# EAGLE design myStrava (EAGLE 6.6.0)
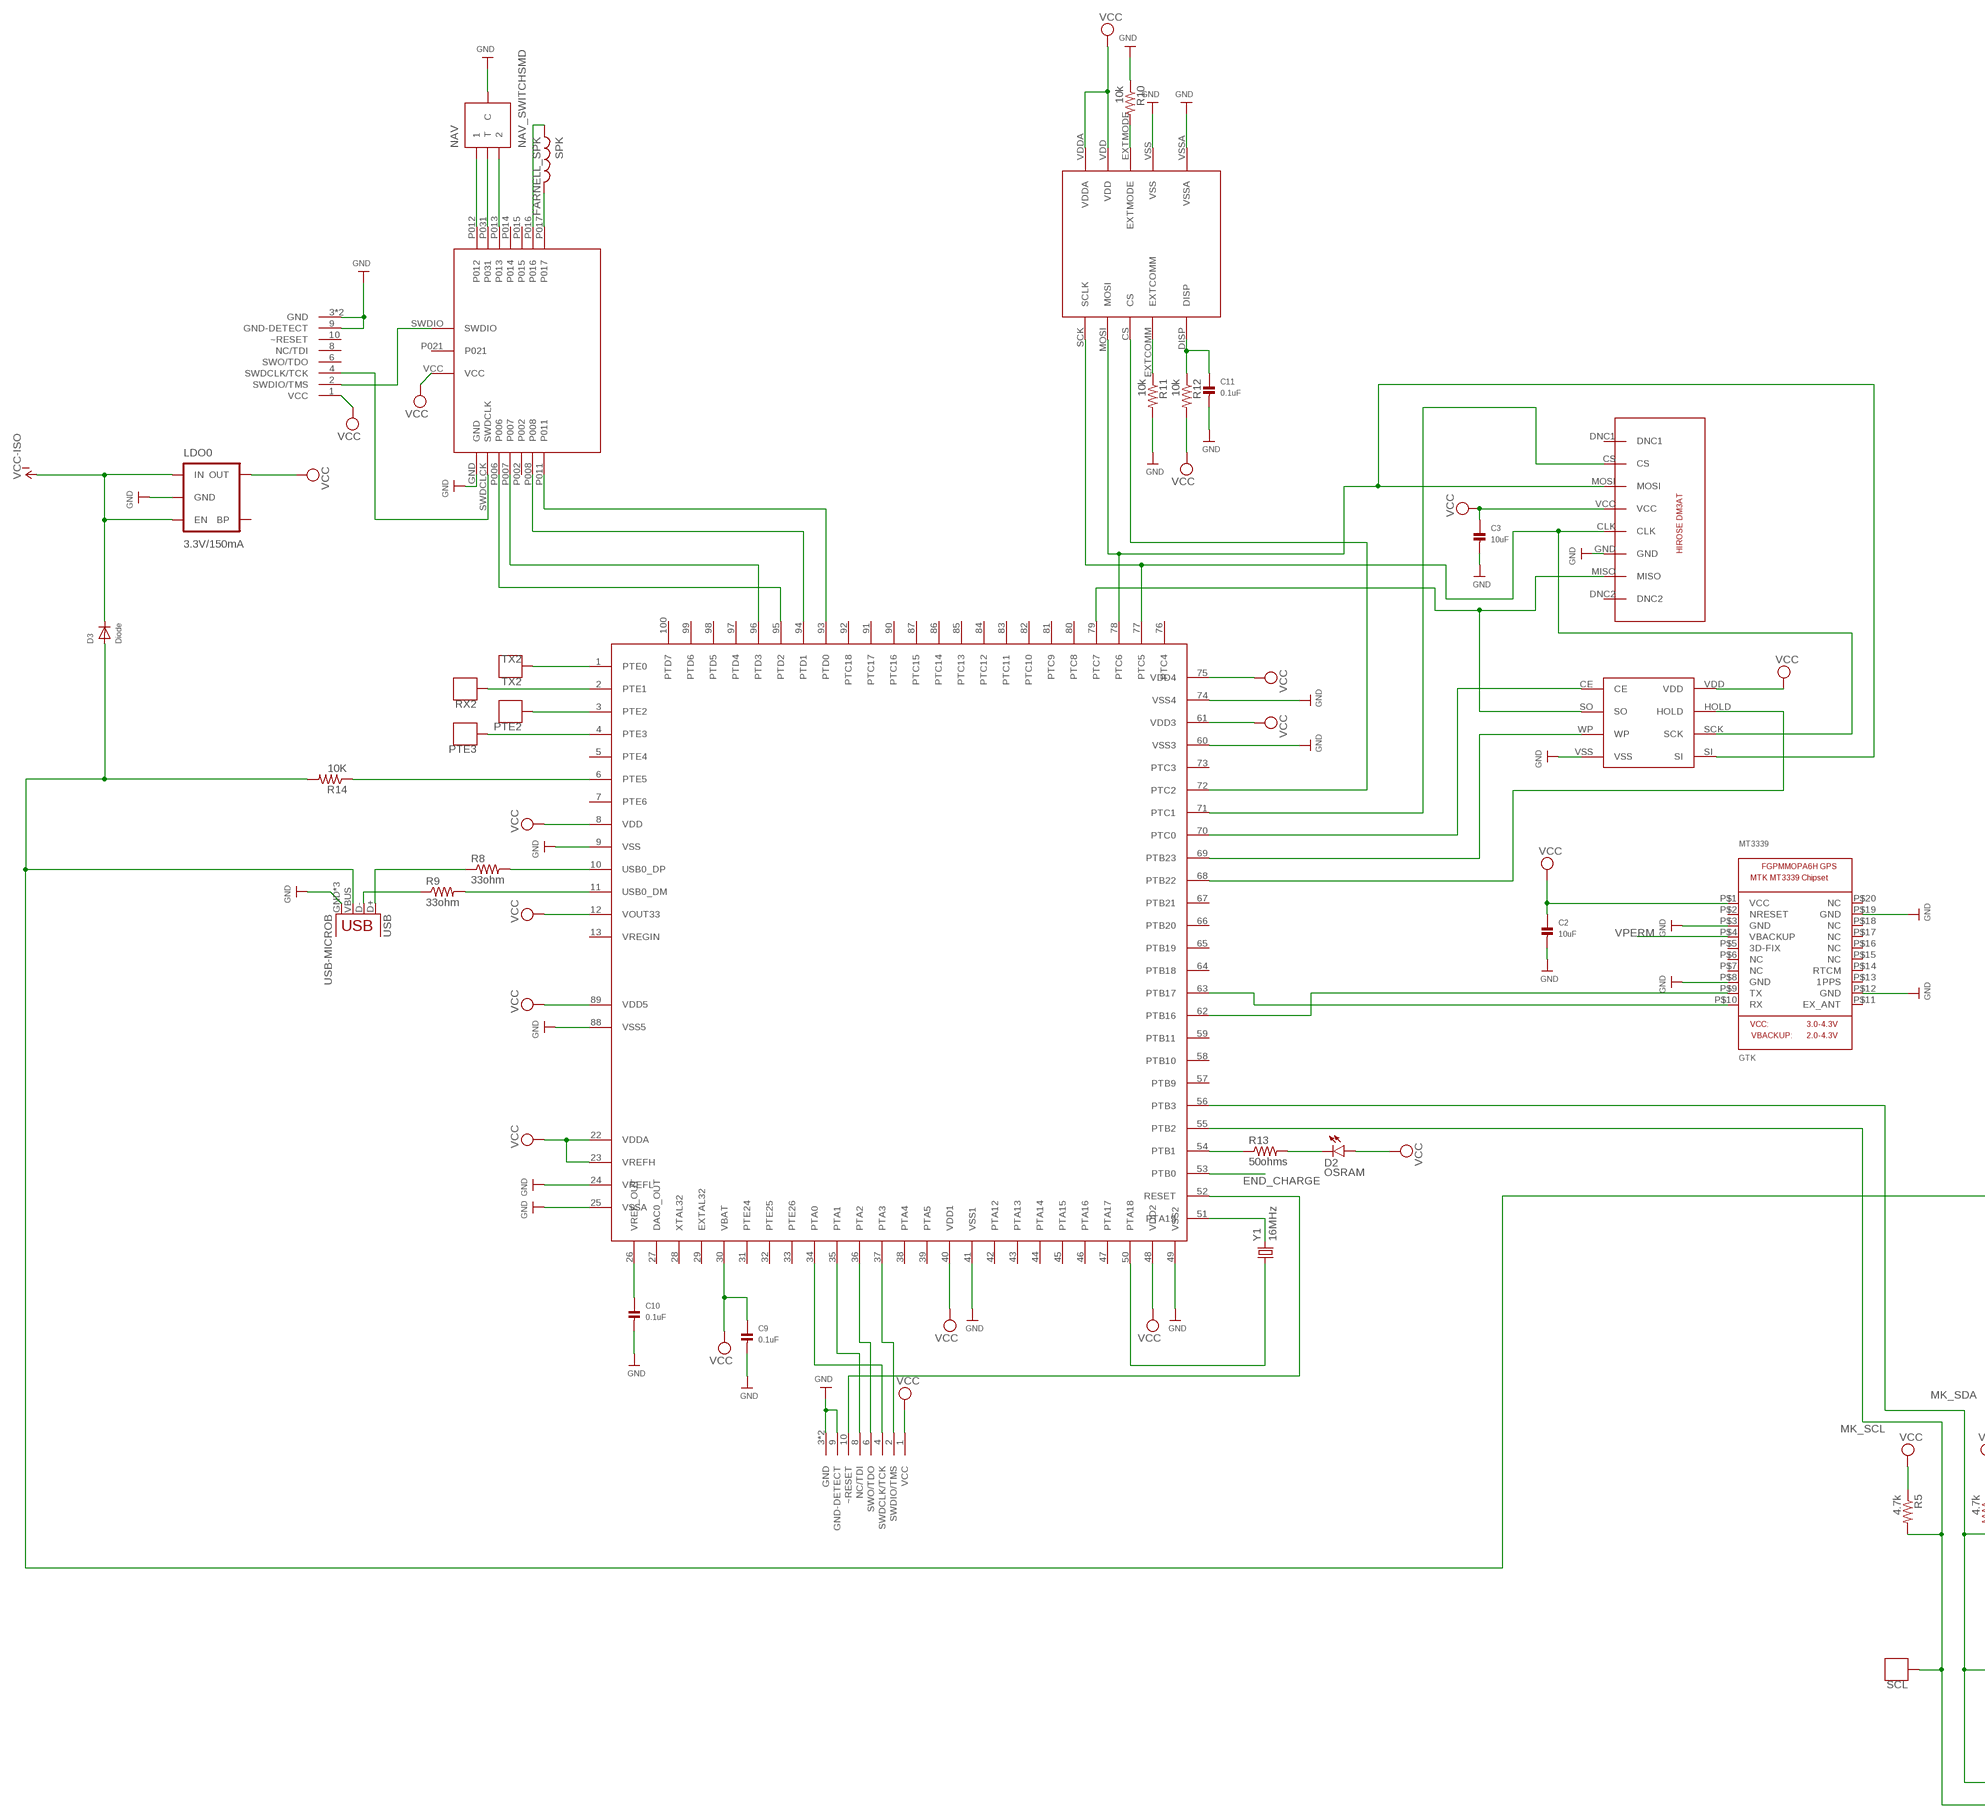
[diagram p0: schematic, sheet 1, part 1 of 2]
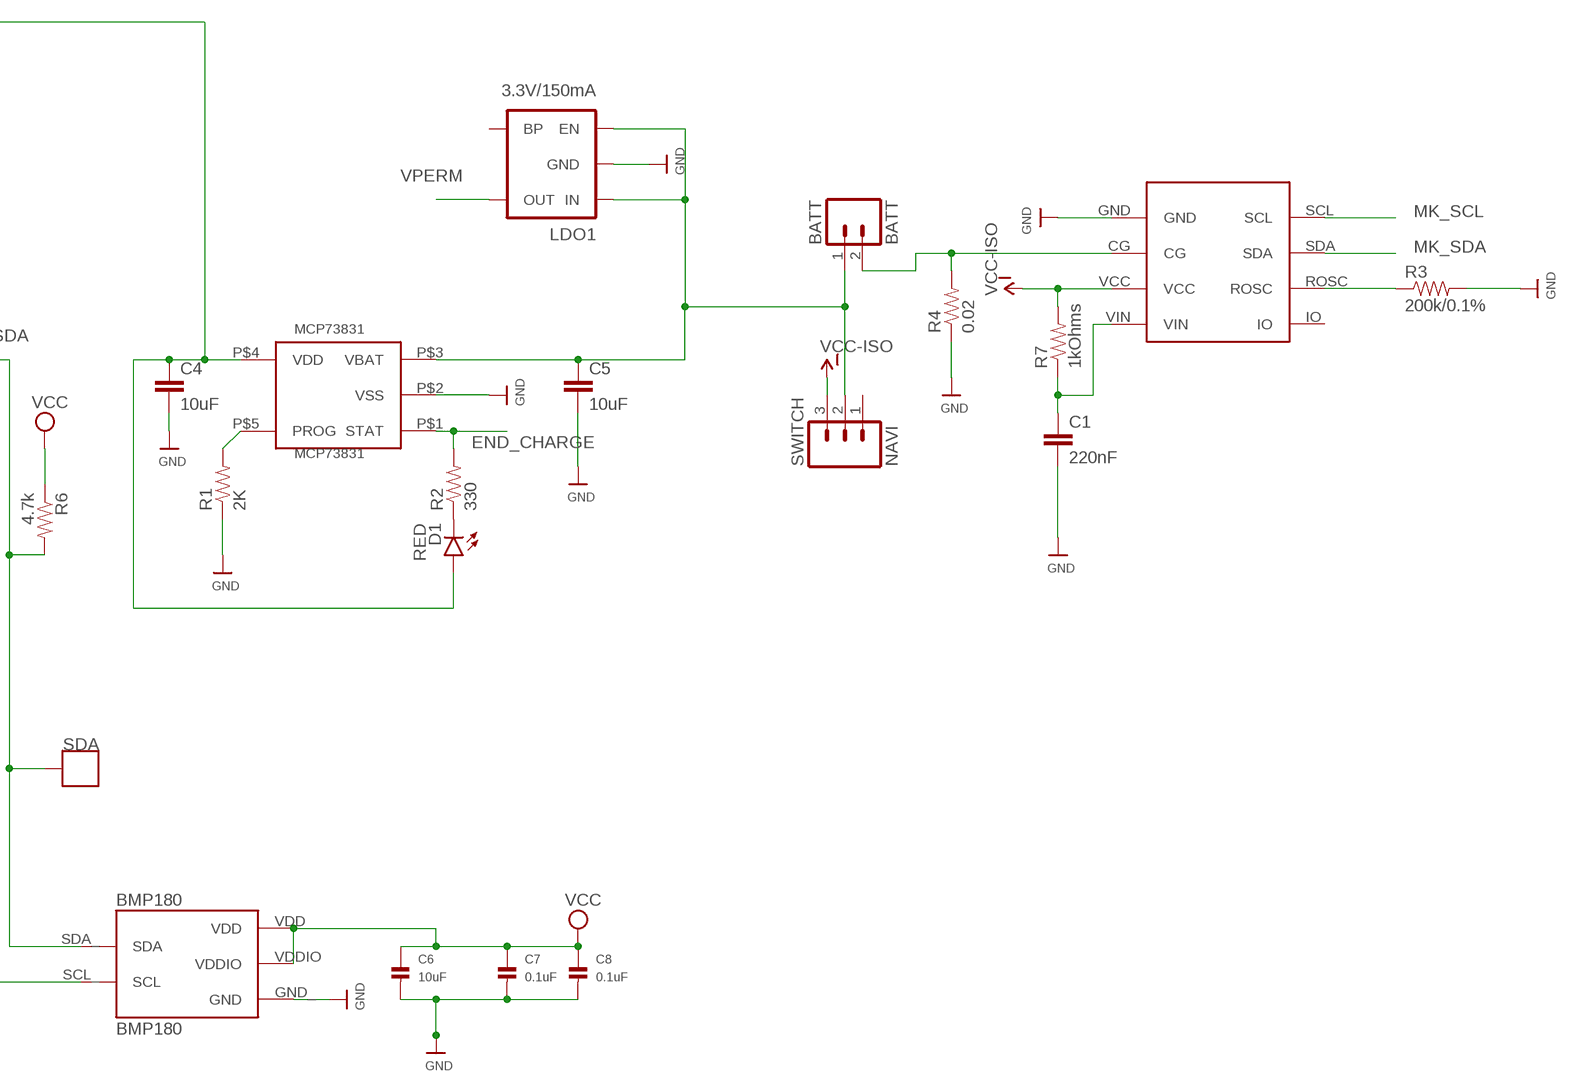
[diagram p1: schematic, sheet 1, part 2 of 2]

## Parts
BATT  BATT  M02PTH3  [1X02_LONGPADS]
BMP180  BMP180  [BMP180]
C1  220nF  10UF-6.3V-20%(1206)  [1206]
C2  10uF  CAP_CERAMIC1206  [1206]
C3  10uF  CAP_CERAMIC1206  [1206]
C4  10uF  10UF-6.3V-20%(1206)  [1206]
C5  10uF  10UF-6.3V-20%(1206)  [1206]
C6  10uF  CAP_CERAMIC1206  [1206]
C7  0.1uF  CAP_CERAMIC1206  [1206]
C8  0.1uF  CAP_CERAMIC1206  [1206]
C9  0.1uF  CAP_CERAMIC1206  [1206]
C10  0.1uF  CAP_CERAMIC1206  [1206]
C11  0.1uF  CAP_CERAMIC1206  [1206]
D1  RED  LED-RED1206  [LED-1206]
D2  OSRAM  LED-RED1206  [LED-1206]
D3  Diode  DIODE_SOD-123FL  [SOD-123FL]
JTAG  2X5_0.05"_CORTEX_DEBUGTH_NOKEY_UNSHROUDED  [2X5_0.05"_TH_NS]
JTAG1  2X5_0.05"_CORTEX_DEBUGTH_NOKEY_UNSHROUDED  [2X5_0.05"_TH_NS]
LDO0  3.3V/150mA  V_REG_MIC52053.3V  [SOT23-5]
LDO1  3.3V/150mA  V_REG_MIC52053.3V  [SOT23-5]
MCP73831  MCP73831  [5PIN_SOT23]
MK20DN512  MK20DN512  [LQFP-100]
MT3339  GTK  GPS_FGPMMOPA6H  [FGPMMOPA6H]
N550  ANTAP28  [ANTAP]
NAV  NAV_SWITCHSMD  [NAV_SWITCH]
PTE2  MDMK2020T4R7MM  [IND-2020]
PTE3  MDMK2020T4R7MM  [IND-2020]
R1  2K  RESISTOR1206  [1206]
R2  330  RESISTOR1206  [1206]
R3  200k/0.1%  RESISTOR1206  [1206]
R4  0.02  RESISTOR1206  [1206]
R5  4.7k  RESISTOR1206  [1206]
R6  4.7k  RESISTOR1206  [1206]
R7  1kOhms  RESISTOR1206  [1206]
R8  33ohm  RESISTOR0805-RES  [0805]
R9  33ohm  RESISTOR0805-RES  [0805]
R10  10k  RESISTOR1206  [1206]
R11  10k  RESISTOR1206  [1206]
R12  10k  RESISTOR1206  [1206]
R13  50ohms  RESISTOR1206  [1206]
R14  10K  RESISTOR1206  [1206]
RX2  MDMK2020T4R7MM  [IND-2020]
SCL  MDMK2020T4R7MM  [IND-2020]
SD  DM3AT  [DM3AT]
SDA  MDMK2020T4R7MM  [IND-2020]
SHARP  SHARP27  [SHARP27]
SPK  FARNELL_SPK  MDMK2020T4R7MM  [IND-2020]
SST25  FLASH  [SOIC8]
STC3100  STC3100  [STC3100]
SWITCH  NAVI  M03LOCK  [1X03_LOCK]
TX2  TX2  MDMK2020T4R7MM  [IND-2020]
USB  USB-MICROB  [USB-MICROB]
Y1  16MHz  CRYSTALHC49UV  [HC49U-V]

## Nets
END_CHARGE: MCP73831.P$1(STAT) MK20DN512.53(PTB0) R2.2
GND [pwr]: BMP180.GND_(GND) C1.2 C2.2 C3.2 C4.2 C5.2 C6.2 C7.2 C8.2 C9.2 C10.2 C11.2 JTAG1.3(GND) JTAG1.5(GND) JTAG1.9(GND-DETECT) JTAG.3(GND) JTAG.5(GND) JTAG.9(GND-DETECT) LDO0.2(GND) LDO1.2(GND) MCP73831.P$2(VSS) MK20DN512.9(VSS) MK20DN512.24(VREFL) MK20DN512.25(VSSA) MK20DN512.41(VSS1) MK20DN512.49(VSS2) MK20DN512.60(VSS3) MK20DN512.74(VSS4) MK20DN512.88(VSS5) MT3339.P$3(GND) MT3339.P$8(GND) MT3339.P$12(GND) MT3339.P$19(GND) N550.GND NAV.C R1.1 R3.2 R4.1 R10.1 R11.2 SD.GND SHARP.VSS SHARP.VSSA SST25.VSS STC3100.GND USB.GND USB.MT1(GND) USB.MT2(GND)
MK_DI: MK20DN512.79(PTC7) SD.MISO SST25.SO
MK_DO: MK20DN512.78(PTC6) SD.MOSI SHARP.MOSI SST25.SI
MK_RX1: MK20DN512.62(PTB16) MT3339.P$9(TX)
MK_RX2: MK20DN512.2(PTE1) RX2.P$1
MK_RX3: MK20DN512.95(PTD2) N550.P006
MK_SCL: BMP180.SCL_(SCL) MK20DN512.55(PTB2) R5.2 SCL.P$1 STC3100.SCL
MK_SCLK: MK20DN512.77(PTC5) SD.CLK SHARP.SCK(SCLK) SST25.SCK
MK_SDA: BMP180.SDA_(SDA) MK20DN512.56(PTB3) R6.2 SDA.P$1 STC3100.SDA
MK_TX1: MK20DN512.63(PTB17) MT3339.P$10(RX)
MK_TX2: MK20DN512.1(PTE0) TX2.P$1
MK_TX3: MK20DN512.96(PTD3) N550.P007
MK_USB_DETECT: MK20DN512.6(PTE5) R14.1
N$1: MK20DN512.71(PTC1) SD.CS
N$2 [charge]: BATT.1 C5.1 LDO1.1(IN) LDO1.3(EN) MCP73831.P$3(VBAT) SWITCH.2
N$3: N550.P017 SPK.P$2
N$4: R3.1 STC3100.ROSC
N$5: C1.1 R7.1 STC3100.VIN
N$6: BATT.2 R4.2 STC3100.CG
N$7: N550.P016 SPK.P$1
N$8: N550.P012 NAV.1
N$9: N550.P031 NAV.T
N$10: N550.P013 NAV.2
N$11: JTAG1.2(SWDIO/TMS) N550.SWDIO
N$12: JTAG1.4(SWDCLK/TCK) N550.SWDCLCK(SWDCLK)
N$14: MK20DN512.51(PTA19) Y1.2
N$15: MK20DN512.69(PTB23) SST25.WP
N$16: MCP73831.P$5(PROG) R1.2
N$17: D2.C R13.2
N$18: MK20DN512.94(PTD1) N550.P008
N$19: MK20DN512.50(PTA18) Y1.1
N$20: D1.C R2.1
N$21: MK20DN512.93(PTD0) N550.P011
N$22: MK20DN512.72(PTC2) SHARP.CS
N$23: C10.1 MK20DN512.26(VREF_OUT)
N$24: MK20DN512.68(PTB22) SST25.HOLD
N$25: R10.2 SHARP.EXTMODE
N$26: R11.1 SHARP.EXTCOMM
N$27: C11.1 R12.1 SHARP.DISP
N$28: MK20DN512.3(PTE2) PTE2.P$1
N$30: MK20DN512.4(PTE3) PTE3.P$1
N$31: MK20DN512.54(PTB1) R13.1
N$32: MK20DN512.70(PTC0) SST25.CE
N$35: JTAG.10(~RESET) MK20DN512.52(RESET)
TCLK: JTAG.4(SWDCLK/TCK) MK20DN512.34(PTA0)
TDI: JTAG.8(NC/TDI) MK20DN512.35(PTA1)
TDO: JTAG.6(SWO/TDO) MK20DN512.36(PTA2)
TMS: JTAG.2(SWDIO/TMS) MK20DN512.37(PTA3)
USB1_DM_N [usb]: R9.1 USB.D-
USB1_DM_P [usb]: R8.1 USB.D+
USB_DM_N [usb]: MK20DN512.11(USB0_DM) R9.2
USB_DM_P [usb]: MK20DN512.10(USB0_DP) R8.2
USB_V+ [charge]: C4.1 D1.A D3.A MCP73831.P$4(VDD) R14.2 USB.VBUS
VCC: BMP180.VDD BMP180.VDDIO C2.1 C3.1 C6.1 C7.1 C8.1 C9.1 D2.A JTAG1.1(VCC) JTAG.1(VCC) LDO0.5(OUT) MK20DN512.8(VDD) MK20DN512.12(VOUT33) MK20DN512.22(VDDA) MK20DN512.23(VREFH) MK20DN512.30(VBAT) MK20DN512.40(VDD1) MK20DN512.48(VDD2) MK20DN512.61(VDD3) MK20DN512.75(VDD4) MK20DN512.89(VDD5) MT3339.P$1(VCC) N550.VCC R5.1 R6.1 R12.2 SD.VCC SHARP.VDD SHARP.VDDA SST25.VDD
VCC-ISO [pwr]: D3.C LDO0.1(IN) LDO0.3(EN) R7.2 STC3100.VCC SWITCH.3
VPERM: LDO1.5(OUT) MT3339.P$4(VBACKUP)
Unconnected: JTAG1.6(SWO/TDO) JTAG1.8(NC/TDI) JTAG1.10(~RESET) LDO0.4(BP) LDO1.4(BP) MK20DN512.5(PTE4) MK20DN512.7(PTE6) MK20DN512.13(VREGIN) MK20DN512.27(DAC0_OUT) MK20DN512.28(XTAL32) MK20DN512.29(EXTAL32) MK20DN512.31(PTE24) MK20DN512.32(PTE25) MK20DN512.33(PTE26) MK20DN512.38(PTA4) MK20DN512.39(PTA5) MK20DN512.42(PTA12) MK20DN512.43(PTA13) MK20DN512.44(PTA14) MK20DN512.45(PTA15) MK20DN512.46(PTA16) MK20DN512.47(PTA17) MK20DN512.57(PTB9) MK20DN512.58(PTB10) MK20DN512.59(PTB11) MK20DN512.64(PTB18) MK20DN512.65(PTB19) MK20DN512.66(PTB20) MK20DN512.67(PTB21) MK20DN512.73(PTC3) MK20DN512.76(PTC4) MK20DN512.80(PTC8) MK20DN512.81(PTC9) MK20DN512.82(PTC10) MK20DN512.83(PTC11) MK20DN512.84(PTC12) MK20DN512.85(PTC13) MK20DN512.86(PTC14) MK20DN512.87(PTC15) MK20DN512.90(PTC16) MK20DN512.91(PTC17) MK20DN512.92(PTC18) MK20DN512.97(PTD4) MK20DN512.98(PTD5) MK20DN512.99(PTD6) MK20DN512.100(PTD7) MT3339.P$2(NRESET) MT3339.P$5(3D-FIX) MT3339.P$6(NC) MT3339.P$7(NC) MT3339.P$11(EX_ANT) MT3339.P$13(1PPS) MT3339.P$14(RTCM) MT3339.P$15(NC) MT3339.P$16(NC) MT3339.P$17(NC) MT3339.P$18(NC) MT3339.P$20(NC) N550.P002 N550.P014 N550.P015 N550.P021 SD.DNC1 SD.DNC2 STC3100.IO SWITCH.1

## Library data of the parts
BATT = SparkFun-Connectors:M02: Standard 2-pin 0.1" header. Use with - straight break away headers ( PRT-00116) - right angle break away headers (PRT-00553) - swiss pins (PRT-00743) - machine pins (PRT-00117) - female headers (PRT-00115) Molex polarized connector foot print use with: PRT-08233 with associated crimp pins and housings. 2.54_SCREWTERM for use with PRT-10571. 3.5mm Screw Terminal footprints for PRT-08084 5mm Screw Terminal footprints for use with PRT-08432
BMP180 = SparkFun-Sensors:BMP180: BOSCH BMP180 DIGITAL BAROMETRIC PRESSURE SENSOR Web page: http://www.bosch-sensortec.com/en/homepage/products_3/environmental_sensors_1/bmp180_1/bmp180 Datasheet: http://ae-bst.resource.bosch.com/media/products/dokumente/bmp180/BST-BMP180-DS000-09.pdf The BMP180 is the function compatible successor of the BMP085, a new generation of high precision digital pressure sensors for consumer applications. The ultra-low power, low voltage electronics of the BMP180 is optimized for use in mobile phones, PDAs, GPS navigation devices and outdoor equipment. With a low altitude noise of merely 0.25m at fast conversion time, the BMP180 offers superior performance. The I2C interface allows for easy system integration with a microcontroller. The BMP180 is based on piezo-resistive technology for EMC robustness, high accuracy and linearity as well as long term stability. Key features: - Temperature measurement included - I2C interface - Fully calibrated - Pb-free, halogen-free and RoHS compliant, - MSL 1 Basic specs: Pressure range: 300 to 1100hPa (+9000m to -500m relating to sea level) Supply voltage: 1.8 to 3.6V (VDD), 1.62V to 3.6V (VDDIO) Package: LGA package with metal lid Small footprint: 3.6mm x 3.8mm Super-flat: 0.93mm height Low power: 5µA at 1 sample / sec. in standard mode Low noise: 0.06hPa (0.5m) in ultra low power mode, 0.02hPa (0.17m) advanced resolution mode Typical applications: - Enhancement of GPS navigation (dead-reckoning, slope detection, etc.) - In- and out-door navigation - Leisure and sports - Weather forecast - Vertical velocity indication (rise/sink speed)
C1 = SparkFun-Capacitors:10UF-6.3V-20%(1206): CAP-10057 Ceramic; PROD_ID: CAP-10057; VALUE: 10uF
C2 C3 C6-C11 = microbuilder:CAP_CERAMIC: Ceramic Capacitors 0402 - 0402 Surface Mount Capacitors 16pF 50V 5% [Digikey: 445-4899-2-ND] 18pF 50V 5% [Digikey: 490-1281-2-ND] 22pF 50V 5% [Digikey: 490-1283-2-ND] 68pF 50V 5% [Digikey: 490-1289-2-ND] 0.1uF 10V 10% [Digikey: 490-1318-2-ND] 1.0uF 6.3V 10% [Digikey: 490-1320-2-ND] 0603 - 0603 Surface Mount Capacitors 16 pF 50V 5% [Digikey: 445-5051-2-ND] 22 pF 50V [Digikey: PCC220ACVTR-ND] 33 pF 50V 5% [Digikey: 490-1415-1-ND] 56pF 50V 5% [Digikey: 490-1421-1-ND] 220pF 50V 5% [Digikey: 445-1285-1-ND] 680 pF 50V 2200 pF 50V 5% C0G [Digikey: 445-1297-1-ND] 5600 pF 100V 5% X7R [Digikey: 478-3711-1-ND] 0.1 µF 25V 10% [Digikey: PCC2277TR-ND] 0.22 µF 16V 10% X7R [Digikey: 445-1318-1-ND] 1.0 µF 25V 10% [Digikey: 445-5146-2-ND] 0603 - RF Specific 3pF 250V +/-0.1pF RF [Digikey: 712-1347-1-ND] 18 pF 250V 5% [Digikey: 478-3505-1-ND or 712-1322-1-ND] 56 pF 250V 5% C0G RF [Digikey: 490-4867-1-ND] 68 pF 250V RF [Digikey: 490-4868-1-ND] 0805 - 0805 Surface Mount Capacitors 220 pF 250V 2% RF Ceramic Capacitor [Digikey: 712-1398-1-ND] 1000 pF 50V 2% NP0 Ceramic Capacitor [Digikey: 478-3760-1-ND] 0.1 µF 25V 10% Ceramic Capacitor [Digikey: PCC1828TR-ND] 1.0 µF 16V 10% Ceramic Capacitor[Digikey: 490-1691-2-ND] 10.0 µF 10V 10% Ceramic Capacitor[Digikey: 709-1228-1-ND] 10.0 uF 16V 10% Ceramic Capacitor [Digikey: 478-5165-2-ND] 47 uF 6.3V 20% Ceramic Capacitor [Digikey: 587-1779-1-ND or 399-5506-1-ND] 1206 - 1206 Surface Mount Capacitors 47uF 10V 20% Ceramic Capacitor [Digikey: 490-5528-1-ND or 399-5508-1-ND or 445-6010-1-ND] 100uF 6.3V -20%, +80% Y5V Ceramic Capacitor (Digikey: 490-4512-1-ND, Mouser: 81-GRM31CF50J107ZE1L)
C4 C5 = SparkFun-Capacitors:10UF-6.3V-20%(1206): CAP-10057 Ceramic; PROD_ID: CAP-10057
D1 = SparkFun-LED:LED-RED: Assorted Red LEDs LilyPad 1206- DIO-09912 1206- DIO-00809 0603- DIO-00819; PROD_ID: DIO-00809
D2 = SparkFun-LED:LED-RED: Assorted Red LEDs LilyPad 1206- DIO-09912 1206- DIO-00809 0603- DIO-00819; PROD_ID: DIO-00809; VALUE: RED
D3 = adafruit:DIODE: Diode SMADIODE - SMA Surface Mount Package 20V 1A Schottky Diode Digikey: 641-1014-6-ND DO-1N4148 - Through Hole Small Current Diode SOD-123 20V 1 A (.5mV Vf) Schottky Diode - Digikey: MBRX120TPMSCT-ND SOD-323 10V 570mA (.38mV Vf, 3ns) Schottky Diode - Digikey: ZLLS410CT-ND SOD-523 30V 30mA Schottky Diode (RB751S-40TE61) - Digikey: RB751S-40TE61CT-ND SOT23-R/W - SOT23 Package (R = Solder Paste/Reflow Ovens, W = Hand-Soldering) BAT54Film 40V 300mA - Digikey: 497-7162-1-ND
JTAG JTAG1 = con-cortex:2X5_0.05"_CORTEX_DEBUG
LDO0 LDO1 = SparkFun-PowerIC:V_REG_MIC5205: V_REG MIC5219 Standard 3.3V and 5V 150mA LDO voltage regulator in SOT-23 layout. Micrel part MIC5205. BP (by-pass) pin is used to lower output noise with 470pF cap, may be left open.; PROD_ID: VREG-00822
MCP73831 = BaseApp:MCP73831: Digikey No:- __MCP73831T-2ACI/OTCT-ND__
MK20DN512 = MK20DN512:MK20DN512
MT3339 = adafruit:GPS_FGPMMOPA6H: GPS Module - MTK MT3339 Chipset, -165dBm sensitivity, 22 channels, 10Hz, auto-select external antenna options
N550 = D52Q:ANTAP28: N548M4CB and ANTAP28 dynastream devices
NAV = SparkFun-Electromechanical:NAV_SWITCH: Navigation Switch Three way navigation switch. Commonly used as up/down/select on MP3 players. Schematic element and footprint production proven. Spark Fun Electronics SKU : COM-08184
PTE2 PTE3 RX2 SCL SDA TX2 = Exposed_pad:MDMK2020T4R7MM: Thing used to expose a pad
R1-R14 = SparkFun-Resistors:RESISTOR: Resistor Basic schematic elements and footprints for 0603, 1206, and PTH resistors.
SD = HIROSE-DM3AT:DM3AT
SHARP = sharp:SHARP27
SPK = Strutz Electronic Industries:MDMK2020T4R7MM
SST25 = FlashMem:FLASH
STC3100 = STC3100:STC3100: The STC3100 monitors the critical parameters of a single-cell Li-Ion battery (voltage, temperature and current) and includes hardware functions to implement a gas gauge for battery charge monitoring, based on a programmable 12- to 14-bit A/D converter. With a typical 30 milliOhms external sense resistor, the battery current can be up to 2.5 A and the accumulator system provides a capacity up to +/-7000 mAh with a resolution of 0.2 mAh. The device is programmable through the I2C interface.
SWITCH = SparkFun-Connectors:M03: Header 3 Standard 3-pin 0.1" header. Use with straight break away headers (SKU : PRT-00116), right angle break away headers (PRT-00553), swiss pins (PRT-00743), machine pins (PRT-00117), and female headers (PRT-00115). Molex polarized connector foot print use with SKU : PRT-08232 with associated crimp pins and housings.
USB = SparkFun-Connectors:USB: USB Connectors USB-B-PTH is fully proven SKU : PRT-00139/CONN-08278 USB-miniB is fully proven SKU : PRT-00587 USB-A-PCB is untested. USB-A-H is throughly reviewed, but untested. Spark Fun Electronics SKU : PRT-00437 USB-B-SMT is throughly reviewed, but untested. Needs silkscreen touching up. USB-A-S has not been used/tested USB-MB-H has not been used/tested USB-MICROB has been used. CONN-09505; PROD_ID: CONN-09505
Y1 = SparkFun-FreqCtrl:CRYSTAL: Various standard crystals. Proven footprints.

## Net classes
0 default: width 0.203 mm, drill 0.152 mm, clearance 0.152 mm
1 pwr: width 0.254 mm, drill 0.152 mm, clearance 0.152 mm
2 charge: width 0.381 mm, drill 0.152 mm, clearance 0.152 mm
3 usb: width 0.432 mm, drill 0.33 mm, clearance 0.152 mm to class 0, clearance 0.152 mm to class 1, clearance 0.152 mm to class 2, clearance 0.152 mm

## Board
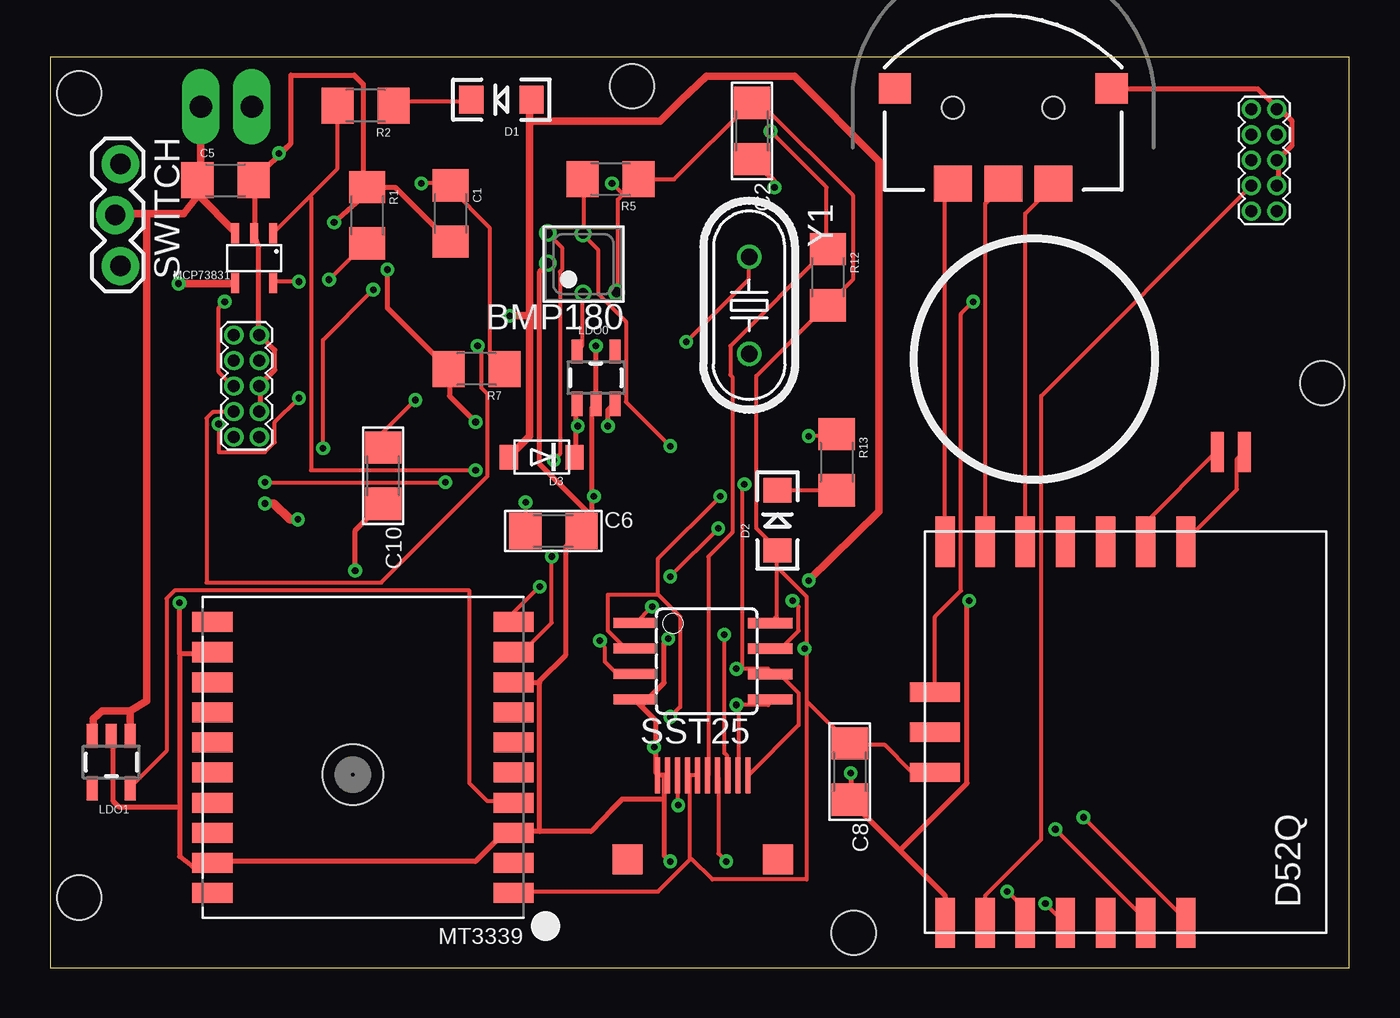
[diagram p2: board, top side]
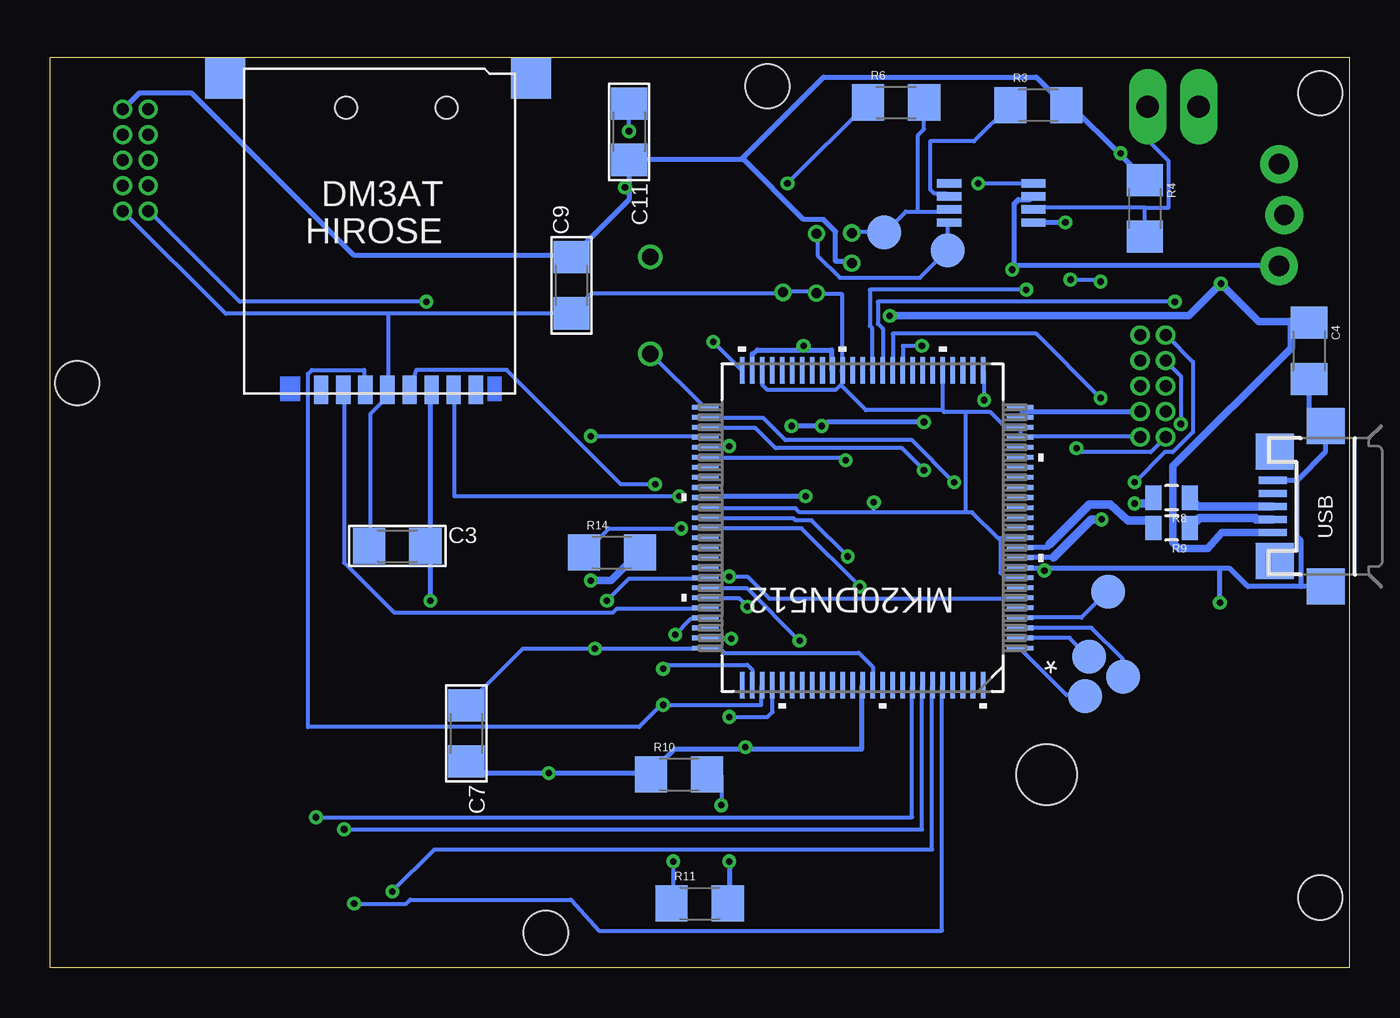
[diagram p3: board, bottom side, seen from below]

Size 64.75 x 45.39 mm. Coordinates in mm from the lower left corner, seen from the top.
Outline: 0,0 64.75,0 64.75,45.39 0,45.39 0,0
Copper layers (1*16): Top 0.0356mm / dielectric 1.5011mm / Bottom 0.0356mm
Design rules "oshpark-2layer": minimum track width 6mil, minimum drill 13mil, track to track 6mil, track to pad 6mil, pad to pad 6mil, via to via 6mil, smd to smd 6mil, copper to edge 15mil, drill to drill 6mil, minimum pad ring 7mil, minimum via ring 7mil, stop-mask expansion 2.5mil, vias tented up to drill 0mil, thermal gap 10mil
Holes 2.2 mm at 63.4,29.15 1.45,3.5 1.45,43.6 40.05,1.75 29,43.95

### Footprints (pad centres in the part's own frame; a part is rotated, then mirrored left to right if it is on the bottom)
1X02_LONGPADS = drill 1.118 pad 1.88 long: 1 0,0; 2 2.54,0
BMP180 = drill 0.5: GND_ 1.78,-0.06; SCL_ 0.02,-1.52; SDA_ 1.78,-1.56; VDD 0.02,1.44; VDDIO -1.65,1.4
1206 = smd 1.6 x 1.8: 1 -1.4,0; 2 1.4,0
LED-1206 = smd 1.2 x 1.4: A -1.5,0; C 1.5,0
SOD-123FL = smd 0.91 x 1.22: A 1.637,0; C -1.637,0
2X5_0.05"_TH_NS = drill 0.6 pad 0.95: 1 -2.54,-0.635; 2 -2.54,0.635; 3 -1.27,-0.635; 4 -1.27,0.635; 5 0,-0.635; 6 0,0.635; 7 1.27,-0.635; 8 1.27,0.635; 9 2.54,-0.635; 10 2.54,0.635
SOT23-5 = smd 0.55 x 1.2: 1 -0.95,-1.3; 2 0,-1.3; 3 0.95,-1.3; 4 0.95,1.3; 5 -0.95,1.3
5PIN_SOT23 = smd 0.4 x 1: P$1 0.4,-0.63; P$2 1.35,-0.63; P$3 2.3,-0.63; P$4 2.3,1.87; P$5 0.4,1.87
LQFP-100 = smd 1.321 x 0.229: 1 -7.85,6; 2 -7.85,5.5; 3 -7.85,5; 4 -7.85,4.5; 5 -7.85,4; 6 -7.85,3.5; 7 -7.85,3; 8 -7.85,2.5; 9 -7.85,2; 10 -7.85,1.5; 11 -7.85,1; 12 -7.85,0.5; 13 -7.85,0; 14 -7.85,-0.5; 15 -7.85,-1; 16 -7.85,-1.5; 17 -7.85,-2; 18 -7.85,-2.5; 19 -7.85,-3; 20 -7.85,-3.5; 21 -7.85,-4; 22 -7.85,-4.5; 23 -7.85,-5; 24 -7.85,-5.5; 25 -7.85,-6; 51 7.85,-6; 52 7.85,-5.5; 53 7.85,-5; 54 7.85,-4.5; 55 7.85,-4; 56 7.85,-3.5; 57 7.85,-3; 58 7.85,-2.5; 59 7.85,-2; 60 7.85,-1.5; 61 7.85,-1; 62 7.85,-0.5; 63 7.85,0; 64 7.85,0.5; 65 7.85,1; 66 7.85,1.5; 67 7.85,2; 68 7.85,2.5; 69 7.85,3; 70 7.85,3.5; 71 7.85,4; 72 7.85,4.5; 73 7.85,5; 74 7.85,5.5; 75 7.85,6 | smd 0.229 x 1.321: 26 -6,-7.85; 27 -5.5,-7.85; 28 -5,-7.85; 29 -4.5,-7.85; 30 -4,-7.85; 31 -3.5,-7.85; 32 -3,-7.85; 33 -2.5,-7.85; 34 -2,-7.85; 35 -1.5,-7.85; 36 -1,-7.85; 37 -0.5,-7.85; 38 0,-7.85; 39 0.5,-7.85; 40 1,-7.85; 41 1.5,-7.85; 42 2,-7.85; 43 2.5,-7.85; 44 3,-7.85; 45 3.5,-7.85; 46 4,-7.85; 47 4.5,-7.85; 48 5,-7.85; 49 5.5,-7.85; 50 6,-7.85; 76 6,7.85; 77 5.5,7.85; 78 5,7.85; 79 4.5,7.85; 80 4,7.85; 81 3.5,7.85; 82 3,7.85; 83 2.5,7.85; 84 2,7.85; 85 1.5,7.85; 86 1,7.85; 87 0.5,7.85; 88 0,7.85; 89 -0.5,7.85; 90 -1,7.85; 91 -1.5,7.85; 92 -2,7.85; 93 -2.5,7.85; 94 -3,7.85; 95 -3.5,7.85; 96 -4,7.85; 97 -4.5,7.85; 98 -5,7.85; 99 -5.5,7.85; 100 -6,7.85
FGPMMOPA6H = smd 2 x 1: P$1 -7.5,6.75; P$2 -7.5,5.25; P$3 -7.5,3.75; P$4 -7.5,2.25; P$5 -7.5,0.75; P$6 -7.5,-0.75; P$7 -7.5,-2.25; P$8 -7.5,-3.75; P$9 -7.5,-5.25; P$10 -7.5,-6.75; P$11 7.5,-6.75; P$12 7.5,-5.25; P$13 7.5,-3.75; P$14 7.5,-2.25; P$15 7.5,-0.75; P$16 7.5,0.75; P$17 7.5,2.25; P$18 7.5,3.75; P$19 7.5,5.25; P$20 7.5,6.75 | hole 3: 0.5,0.85
ANTAP = smd 2.5 x 0.965: GND 0.5,19; P002 0.5,11; P006 0.5,15; P007 0.5,13; P008 0.5,9; P011 0.5,7; P012 19.5,19; P013 19.5,15; P014 19.5,13; P015 19.5,11; P016 19.5,9; P017 19.5,7; P031 19.5,17; SWDCLCK 0.5,17 | smd 0.965 x 2.5: P021 10,19.5; SWDIO 12,19.5; VCC 8,19.5
NAV_SWITCH = smd 1.9 x 1.8: 1 -2.5,-3.8; 2 2.5,-3.8; T 0,-3.8 | smd 1.6 x 1.5: C 5.4,0.95; NC -5.4,0.95 | hole 1.1: -2.5,0; 2.5,0
IND-2020 = smd 1.7 x 1.7: P$1 0.325,1
0805 = smd 0.8 x 1.2: 1 -0.9,0; 2 0.9,0
DM3AT = smd 0.711 x 1.422: CLK -1.56,6.63; CS 1.74,6.63; DNC1 2.84,6.63; DNC2 -4.86,6.63; GND -2.66,6.63; MISO -3.76,6.63; MOSI 0.64,6.63; VCC -0.46,6.63 | smd 2 x 2: P$1 -7.62,-8.89; P$2 7.62,-8.89
SHARP27 = smd 1.8 x 0.25 bottom: CS -4.12,0.79; DISP -4.12,1.79; EXTCOMM -4.12,1.29; EXTMODE -4.12,3.29; MOSI -4.12,0.29; SCK -4.12,-0.21; VDD -4.12,2.79; VDDA -4.12,2.29; VSS -4.12,3.79; VSSA -4.12,4.29 | smd 1.5 x 1.5 bottom: P$8 0.06,5.79; P$9 0.06,-1.71
IND-2020' = smd 0.65 x 2: P$1 0.325,1; P$2 1.675,1
SOIC8 = smd 2.2 x 0.5: CE 1.526,4.445; HOLD 8.234,3.165; SCK 8.234,1.895; SI 8.234,0.635; SO 1.526,3.175; VDD 8.234,4.435; VSS 1.526,0.635; WP 1.526,1.905
STC3100 = smd 1.213 x 0.406: CG 4.1,0.65; GND 4.1,0; IO -0.1,1.95; ROSC -0.1,1.3; SCL -0.1,0; SDA -0.1,0.65; VCC 4.1,1.3; VIN 4.1,1.95
1X03_LOCK = drill 1.016 pad 1.88: 1 0,0.127; 2 2.54,-0.127; 3 5.08,0.127
USB-MICROB = smd 0.35 x 1.4: D+ 0,2.65; D- -0.65,2.65; GND 1.3,2.65; ID 0.65,2.65; VBUS -1.3,2.65 | smd 1.8 x 1.9: MT1 -4,0; MT2 4,0; MT3 -2.73,2.54; MT4 2.73,2.54
HC49U-V = drill 0.813: 1 -2.413,0; 2 2.413,0

### Placement (x,y rotation side)
BATT  7.51,42.92 0 top
BMP180  26.58,35.07 180 top
C1  19.95,37.6 270 top
C2  34.97,41.71 270 top
C3  47.45,21.02 0 bottom
C4  2.01,30.75 270 bottom
C5  8.74,39.25 0 top
C6  25.08,21.78 0 top
C7  44.01,11.68 270 bottom
C8  39.85,9.78 270 top
C9  38.76,34.02 90 bottom
C10  16.59,24.53 270 top
C11  35.9,41.67 270 bottom
D1  22.49,43.27 180 top
D2  36.25,22.3 90 top
D3  24.5,25.45 180 top
JTAG  9.79,29 90 top
JTAG1  60.5,40.25 90 top
LDO0  27.2,29.41 0 top
LDO1  3.05,10.25 180 top
MCP73831  11.52,35.99 180 top
MK20DN512  24.26,21.94 180 bottom
MT3339  15.59,10.48 180 top
N550  63.6,1.74 90 top
NAV  47.5,42.88 0 top
PTE2  11.6,13.5 0 bottom
PTE3  12.35,17.75 0 bottom
R1  15.79,37.51 270 top
R2  15.72,42.97 180 top
R3  15.5,43 0 bottom
R4  10.2,37.85 270 bottom
R5  27.93,39.3 180 top
R6  22.59,43.13 0 bottom
R7  21.25,29.85 180 top
R8  8.86,23.43 180 bottom
R9  8.86,21.92 180 bottom
R10  33.41,9.64 0 bottom
R11  32.38,3.21 0 bottom
R12  38.76,34.42 270 top
R13  39.2,25.2 270 top
R14  36.75,20.7 0 bottom
RX2  13.3,14.5 0 bottom
SCL  20.35,34.75 0 bottom
SD  48.4,35.44 180 bottom
SDA  23.5,35.65 0 bottom
SHARP  34.56,5.47 270 bottom
SPK  FARNELL_SPK  [IND-2020']  57.85,24.7 0 top
SST25  27.65,12.74 0 top
STC3100  19.85,37.15 0 bottom
SWITCH  3.37,40.06 270 top
TX2  13.5,12.55 0 bottom
USB  1.17,23 90 bottom
Y1  34.84,33.02 270 top

### Tracks (layer width: path | path; a pad name or v marks a point on that pad's centre or on a via)
END_CHARGE  (via drill 0.33)
  Top 0.203: 12.95,38.45 14.3,39.8 14.3,42.9 R2.2 | 12.95,38.45 MCP73831.P$1 | v21.2,24.8 13,24.8 13,38.4 12.95,38.45
  Bottom 0.203: v21.2,24.8 22.3,25.9 28.6,25.9 29.6,26.9 32.1,26.9 MK20DN512.53
GND  (via drill 0.33)
  Top 0.254: v14.15,37.15 15.7,38.5 15.7,38.9 R1.1 | C1.2 19.9,36.2 17.2,38.9 15.9,38.9 R1.1 | JTAG.3 10.5,27.8 10.5,29 JTAG.5 10.5,29.1 11.2,29.8 11.2,30.8 10.5,31.5 JTAG.9 10.4,31.6 10.4,35.95 10.2,36.5 MCP73831.P$2 10.2,36.7 10.2,39.2 C5.2 10.2,39.3 12,41.1 | R1.1 15.6,39.35 15.6,44.05 15.15,44.5 12,44.5 12,41.1 | v11.4,40.6 12,41.1 | v36.1,38.9 36.1,39.2 35,40.3 C2.2 | v15.2,19.8 15.2,21.8 16.5,23.1 C10.2 | 27,23.5 27,22.3 C6.2 | 27,23.5 27,27.9 LDO0.2 v27.2,31 | v27.1,23.5 27,23.5 | BMP180.GND_ 24.8,35.1 24.4,34.7 24.4,25.1 26.9,22.6 C6.2 | 6.45,15.65 6.45,8 | 6.45,8 6.45,5.55 7.1,5.05 MT3339.P$19 8.2,5.3 21.2,5.3 22.6,6.7 23,6.7 MT3339.P$3 23.1,6.8 24.4,6.8 | 6.45,15.65 7.55,15.65 8,15.7 MT3339.P$12 | 30.6,9.6 30.7,9.6 SHARP.VSS | 30.6,9.6 30.3,9.6 SHARP.VSSA 30.2,9.7 30.2,11 | v30.9,5.3 30.6,5.6 30.6,8.4 | 30.6,9.6 30.6,8.4 | 24.4,6.8 26.95,6.8 28,7.9 28.5,8.4 30.6,8.4 | 24.4,14.2 23.1,14.2 MT3339.P$8 | 24.4,6.8 24.4,14.2 | 29.45,13.05 30.2,12.3 30.2,11 | 29.45,13.05 29.2,13.3 SST25.VSS | C6.2 25.7,21 25.7,15.6 24.4,14.3 24.4,14.2 | v30.1,11 30.2,11 | 6.45,15.65 v6.45,18.2 | 42.35,5.85 44.6,3.6 N550.GND | 42.35,5.85 39.9,8.3 C8.2 39.9,8.4 v39.9,9.7 | v45.8,18.3 45.7,18.2 45.7,9.2 42.35,5.85 | v30.8,16.4 30.6,16.2 30.6,14.2 29.45,13.05 | NAV.C 52.9,43.8 60.2,43.8 61.1,42.9 61.1,42.8 JTAG1.9 61.2,42.9 61.9,42.2 61.9,41 61.2,40.3 JTAG1.5 61.2,40.2 61.2,39 JTAG1.3 | 6.45,8 3.45,8 3.15,8.3 3.15,11.3 3.1,11.5 LDO1.2
  Bottom 0.254: 11.45,40.55 13.9,43 R3.2 14.2,43 15.6,44.4 26.2,44.4 30.25,40.35 | 11.45,40.55 10.2,39.3 R4.1 | v14.15,37.15 STC3100.GND | 16.3,27.7 16.4,27.9 MK20DN512.25 | 16.3,27.7 16.35,27.5 MK20DN512.24 | 16.3,27.7 10.5,27.7 JTAG.3 | v11.4,40.6 11.45,40.55 | 35.9,38.9 C11.2 35.8,40.3 30.3,40.3 30.25,40.35 | 35.9,38.9 35.9,38.3 38.7,35.5 C9.2 38.8,35.5 49.6,35.5 57.7,43.6 60.3,43.6 61.1,42.8 61.2,42.8 JTAG1.9 | v36.1,38.9 35.9,38.9 | 2.6,24.3 USB.GND | 2.6,24.3 1.2,25.7 1.2,27 USB.MT2 1.2,27.1 2,27.1 2,29.3 C4.2 | 6.45,19.9 5.95,19.9 5.05,19 2.4,19 | 6.45,19.9 15.2,19.9 | 15.2,19.9 16.4,19.9 MK20DN512.9 | USB.MT1 2.4,19 | v15.2,19.8 15.2,19.9 | 2.6,24.3 2.6,21.5 2.4,21.3 2.4,19 | 30.1,10.9 33.6,10.9 34.8,9.7 R10.1 34.9,9.7 v39.9,9.7 43.5,9.7 44,10.2 C7.2 | 30.1,10.9 24.3,10.9 24.3,14 MK20DN512.88 | 27.2,30.8 29.5,30.8 29.75,30.6 MK20DN512.49 | 27.2,30.8 25.8,30.8 25.8,29.8 MK20DN512.41 | v27.1,23.5 32.1,23.5 MK20DN512.60 | v27.2,31 27.2,30.8 | v30.9,5.3 30.9,3.3 R11.2 | v30.1,11 30.1,10.9 | v6.45,18.2 6.45,19.9 | 30.25,40.35 27.2,37.3 26.2,37.3 25.6,36.7 25.6,35.2 24.8,35.2 BMP180.GND_ | SD.GND 45.8,28.8 45.8,21.1 46,21.1 C3.2 45.8,21 v45.8,18.3 | v30.8,16.4 32.1,16.4 MK20DN512.74
MK_DI  (via drill 0.33)
  Top 0.203: v30.9,12.5 31.4,13 31.4,17.5 30.3,18.6 | 30.3,18.6 27.8,18.6 27.8,16.8 28.6,16 29.1,16 SST25.SO | v33.4,23.5 30.3,20.4 30.3,18.6
  Bottom 0.203: v30.9,12.5 29,12.5 28.75,12.75 MK20DN512.79 | v33.4,23.5 44.6,23.5 44.6,28.8 SD.MISO
MK_DO  (via drill 0.33)
  Top 0.203: SST25.SI 35.8,13.3 35.8,13.1 v34.2,13.1 34.3,13 34.3,9.6 SHARP.MOSI
  Bottom 0.203: MK20DN512.78 29.3,14 29.3,13.1 v34.2,13.1 34.3,13.1 35.4,12 51.9,12 51.9,29.6 51.7,29.8 49.1,29.8 49.1,28.9 SD.MOSI
MK_RX1  (via drill 0.33)
  Top 0.203: v25,20.5 25,17.2 23.6,15.8 23.1,15.8 MT3339.P$9
  Bottom 0.203: v25,20.5 26.8,22.3 27.6,22.3 27.7,22.4 32.1,22.4 MK20DN512.62
MK_RX2
  Bottom 0.203: MK20DN512.2 16.45,16.45 13.95,16.45 13,15.5 RX2.P$1
MK_RX3  (via drill 0.33)
  Top 0.203: v47.7,3.8 48.6,2.9 N550.P006
  Bottom 0.203: v47.7,3.8 45.6,5.9 20.8,5.9 20.8,14 MK20DN512.95
MK_SCL  (via drill 0.33)
  Top 0.203: v30.9,26 28.7,28.2 28.7,32.2 27.3,33.6 27.3,35.8 26.6,36.5 BMP180.SCL_ 26.6,36.6 26.6,39.3 R5.2
  Bottom 0.203: STC3100.SCL 20,37.1 20,35.8 SCL.P$1 20.1,35.7 21.4,34.4 25.4,34.4 26.5,35.5 26.5,36.5 BMP180.SCL_ | v30.9,26 30.95,25.95 MK20DN512.55
MK_SCLK  (via drill 0.33)
  Top 0.203: v34.6,24.1 34.5,24 34.5,15 v34.2,14.9 35.8,14.9 35.8,14.7 SST25.SCK 35.9,14.6 36.4,14.6 37.3,13.7 37.3,12.1 34.8,9.6 SHARP.SCK
  Bottom 0.203: v34.2,14.9 34,15.1 30,15.1 29.75,14.85 MK20DN512.77 | SD.CLK 46.5,29.8 42,29.8 36.3,24.1 v34.6,24.1
MK_SDA  (via drill 0.33)
  Top 0.203: v25.1,25.3 25.4,25.6 25.4,34.7 25.5,34.8 25.5,35.9 24.8,36.6 BMP180.SDA_
  Bottom 0.203: 21.5,37.7 22.1,37.7 23.1,36.7 SDA.P$1 23.2,36.7 24.8,36.7 BMP180.SDA_ | 21.5,37.7 20.1,37.7 20,37.8 STC3100.SDA | 21.5,37.7 21.5,41.5 21.2,41.8 21.2,43.1 R6.2 | v25.1,25.3 25.2,25.4 32.1,25.4 MK20DN512.56
MK_TX1  (via drill 0.33)
  Top 0.203: v24.4,19 23.1,17.7 23.1,17.3 MT3339.P$10
  Bottom 0.203: v24.4,19 27.3,21.9 32.1,21.9 MK20DN512.63
MK_TX2
  Bottom 0.203: MK20DN512.1 16.4,15.9 14.1,13.6 13.2,13.6 TX2.P$1
MK_TX3  (via drill 0.33)
  Top 0.203: v49.6,3.2 50.6,2.2 N550.P007
  Bottom 0.203: v49.6,3.2 47,3.2 46.8,3.4 38.8,3.4 37.4,1.85 20.3,1.85 20.3,14 MK20DN512.96
MK_USB_DETECT  (via drill 0.33)
  Top 0.203: v33.3,21.9 v30.9,19.5
  Bottom 0.203: v30.9,19.5 30,19.5 28.9,18.4 16.5,18.4 MK20DN512.6 | v33.3,21.9 36.9,21.9 38.1,20.7 R14.1
N$1
  Bottom 0.203: MK20DN512.71 32.2,17.9 36.5,17.9 36.7,17.7 47.6,17.7 50.1,20.2 50.1,28.8 SD.CS
N$2
  Top 0.381: MCP73831.P$3 9.2,36.7 7.4,38.5 7.4,39.2 C5.1 | C5.1 7.4,39.4 7.5,39.5 7.5,42.9 BATT.1 | 4.8,37.6 6.65,37.6 7.3,38.4 C5.1 | 4.8,37.6 3.3,37.6 SWITCH.2 | 4,12.8 2.6,12.8 2.15,12.4 2.15,11.9 2.1,11.6 LDO1.3 | LDO1.1 4,12.8 | 4,12.8 4.8,13.3 4.8,37.6
N$3
  Top 0.203: SPK.P$2 59.5,25.7 59.15,25.35 59.15,23.85 56.6,21.3 N550.P017
N$4
  Bottom 0.203: STC3100.ROSC 20.1,38.6 20.7,38.6 20.9,38.8 20.9,41.2 18.7,41.2 R3.1
N$5  (via drill 0.33)
  Top 0.203: v18.5,39.1 19.9,39.1 19.9,39 C1.1 19.9,38.9 21.9,36.9 21.9,30.6 R7.1
  Bottom 0.203: v18.5,39.1 STC3100.VIN
N$6
  Bottom 0.203: 10.2,37.9 15.6,37.9 15.7,37.8 STC3100.CG | R4.2 10.2,37.9 | 10.2,37.9 9,37.9 9,40.2 10,41.2 10,42.9 BATT.2
N$7
  Top 0.203: N550.P016 54.6,22.2 58.1,25.7 SPK.P$1
N$8
  Top 0.203: N550.P012 44.6,38.6 45,39 NAV.1
N$9
  Top 0.203: N550.P031 46.6,38.1 47.5,39 NAV.T
N$10
  Top 0.203: N550.P013 48.6,37.6 50,39 NAV.2
N$11  (via drill 0.33)
  Top 0.203: v46,33.2 45.4,32.6 45.4,18.8 44.1,17.5 N550.SWDIO
  Bottom 0.203: v46,33.2 55.3,33.2 59.8,37.7 JTAG1.2
N$12
  Top 0.203: N550.SWDCLCK 46.6,3.6 49.4,6.4 49.4,28.5 59.8,38.9 JTAG1.4
N$14
  Bottom 0.203: MK20DN512.51 32.2,28 34.8,30.6 Y1.2
N$15  (via drill 0.33)
  Top 0.203: v27.4,16.3 27.65,15.95 27.65,15.25 28.2,14.7 29.1,14.7 SST25.WP
  Bottom 0.203: v27.4,16.3 30,18.9 32.1,18.9 MK20DN512.69
N$16  (via drill 0.33)
  Top 0.203: v12.4,34.2 11.2,34.2 MCP73831.P$5 | v13.9,34.3 15.7,36.1 R1.2
  Bottom 0.203: v12.4,34.2 12.5,34.3 v13.9,34.3
N$17
  Top 0.203: R13.2 D2.C
N$18  (via drill 0.33)
  Top 0.203: v50.1,6.9 54.6,2.4 N550.P008
  Bottom 0.203: v50.1,6.9 21.3,6.9 21.3,14 MK20DN512.94
N$19  (via drill 0.33)
  Top 0.203: v31.7,31.2 34.8,34.3 34.8,35.4 Y1.1
  Bottom 0.203: v31.7,31.2 30.3,29.8 MK20DN512.50
N$20
  Top 0.203: D1.C 20.9,43.2 17.2,43.2 17.2,43 R2.1
N$21  (via drill 0.33)
  Top 0.203: v51.5,7.5 56.6,2.4 N550.P011
  Bottom 0.203: v51.5,7.5 21.8,7.5 21.8,14 MK20DN512.93
N$22  (via drill 0.33)
  Top 0.203: v33.6,16.6 33.6,10.7 33.75,10.55 33.75,9.55 SHARP.CS
  Bottom 0.203: v33.6,16.6 32.8,17.4 32.2,17.4 MK20DN512.72
N$23  (via drill 0.33)
  Top 0.203: v18.2,28.3 16.6,26.7 16.6,26 C10.1
  Bottom 0.203: v18.2,28.3 18.2,29.7 MK20DN512.26
N$24  (via drill 0.33)
  Top 0.203: v37,18.3 37.3,18 37.3,16.8 36.5,16 35.9,16 SST25.HOLD
  Bottom 0.203: v37,18.3 35.9,19.4 32.2,19.4 MK20DN512.68
N$25  (via drill 0.33)
  Top 0.203: v31.3,8.1 31.3,9.5 SHARP.EXTMODE
  Bottom 0.203: v31.3,8.1 31.3,9.6 32,9.6 R10.2
N$26  (via drill 0.33)
  Top 0.203: v33.7,5.3 33.3,5.7 33.3,9.5 SHARP.EXTCOMM
  Bottom 0.203: v33.7,5.3 33.7,3.3 R11.1
N$27  (via drill 0.33)
  Top 0.203: SHARP.DISP 32.8,9.6 32.8,20.5 34,21.7 34,29.45 33.9,29.55 33.9,31 38.7,35.8 R12.1 38.7,35.9 38.7,38.9 v35.9,41.7
  Bottom 0.203: v35.9,41.7 C11.1
N$28
  Bottom 0.203: MK20DN512.3 16.45,16.95 12.85,16.95 11.3,15.4 11.3,14.5 PTE2.P$1
N$30
  Bottom 0.203: MK20DN512.4 16.45,17.45 13.35,17.45 12.1,18.7 PTE3.P$1
N$31  (via drill 0.33)
  Top 0.203: v37.8,26.5 39.2,26.5 R13.1
  Bottom 0.203: v37.8,26.5 32.2,26.5 MK20DN512.54
N$32  (via drill 0.33)
  Top 0.203: v30,18 29.2,17.2 SST25.CE
  Bottom 0.203: v30,18 30.4,18.4 32.1,18.4 MK20DN512.70
N$35  (via drill 0.33)
  Top 0.203: v10.7,24.2 v19.7,24.2
  Bottom 0.203: v19.7,24.2 21.8,26.3 28.1,26.3 29.2,27.4 32.1,27.4 MK20DN512.52 | v10.7,24.2 9.2,25.7 8.8,25.7 7.8,26.7 7.8,30.2 9.1,31.5 JTAG.10
TCLK  (via drill 0.33)
  Top 0.203: v21.3,31 21.5,30.8 21.5,28.9 21.8,28.6 21.8,24.5 16.5,19.2 7.8,19.2 7.8,27.4 8.1,27.7 9.1,27.7 JTAG.4
  Bottom 0.203: v21.3,31 22.25,31 MK20DN512.34
TDI  (via drill 0.33)
  Top 0.203: v12.4,28.4 11.2,27.2 11.2,26.2 10.7,25.7 8.4,25.7 v8.4,27.1
  Bottom 0.203: v12.4,28.4 15.6,31.6 22.75,31.6 MK20DN512.35 | v8.4,27.1 8.4,29.5 9.1,30.2 JTAG.8
TDO  (via drill 0.33)
  Top 0.203: v8.7,33.2 8.4,32.9 8.4,29.7 9.1,29 JTAG.6
  Bottom 0.203: v8.7,33.2 23.5,33.2 23.5,32.1 23.25,31.85 MK20DN512.36
TMS  (via drill 0.33)
  Top 0.203: v16.1,33.8 13.6,31.3 v13.6,25.9
  Bottom 0.203: v16.1,33.8 23.9,33.8 23.9,32 23.8,31.9 23.8,29.8 MK20DN512.37 | v13.6,25.9 13.4,25.7 9.9,25.7 9.2,26.4 JTAG.2
USB1_DM_N
  Bottom 0.432: USB.D- 4.65,22.35 4.65,22.41 7.47,22.41 R9.1
USB1_DM_P
  Bottom 0.432: USB.D+ 4.65,23 4.65,22.99 7.52,22.99 R8.1
USB_DM_N
  Bottom 0.254: 14.95,21.1 15,20.95 15.2,20.94 MK20DN512.11
  Bottom 0.432: R9.2 9.85,22.31 10.1,22.31 10.16,22.3 11.05,22.3 11.9,23.1 12.95,23.1 14.95,21.1
USB_DM_P  (via drill 0.33)
  Top 0.432: v10.7,23.14 11.06,23.15 11.15,23.15 11.95,22.35 v12.35,22.35
  Bottom 0.203: 16.3,20.45 MK20DN512.10
  Bottom 0.254: 14.75,20.45 16.3,20.45
  Bottom 0.432: R8.2 10.15,23.14 v10.7,23.14 | v12.35,22.35 12.85,22.35 14.75,20.45
USB_V+  (via drill 0.33)
  Top 0.381: v6.4,34.1 9.2,34.1 MCP73831.P$4 | 23.9,42.2 23.9,43.2 D1.A | 23.9,42.2 23.9,32.5 | 23.9,32.5 23.9,26.5 22.9,25.5 D3.A | v37.8,19.3 41.3,22.75 41.3,40.2 37.1,44.45 32.7,44.45 31.45,43.25 30.4,42.2 23.9,42.2 | 23.9,32.5 v22.9,32.5
  Bottom 0.381: USB.VBUS 6.35,21.7 7.05,20.9 8.5,20.9 8.8,21.2 8.8,25 2.9,30.9 2.9,32.1 C4.1 2.1,32.2 4.5,32.2 v6.4,34.1 8,32.5 v22.9,32.5 | v37.8,19.3 36.8,19.3 35.4,20.7 R14.2
VCC  (via drill 0.33)
  Top 0.203: LDO0.5 26.3,30.8 26.5,31 26.5,33.6 BMP180.VDD | 28.55,38.55 28.3,38.3 28.3,33.7 BMP180.VDDIO | 28.55,38.55 29.3,39.3 R5.1 31.1,39.3 34.9,43.1 C2.1 35,43.1 35.4,43.1 40,38.5 40,34.3 38.8,33.1 R12.2 38.7,33 35.2,29.5 35.2,21.9 36.2,20.9 D2.A 36.2,20.8 36.2,19.9 | 28.55,38.55 v28,39.1 | v23.7,23.2 23.7,21.8 C6.1 | 31.9,9.6 32.2,9.6 SHARP.VDDA | 31.9,9.6 31.8,9.6 SHARP.VDD | 31.9,5.4 31.9,9.6 | 31.9,5.4 30.3,3.8 23.1,3.8 MT3339.P$1 | N550.VCC 44.1,9.8 42.9,9.8 41.6,11.1 39.9,11.1 C8.1 39.8,11.2 37.75,13.25 | 36.2,19.9 36.2,17.5 35.9,17.2 SST25.VDD | 37.75,13.25 37.7,13.3 37.7,15.9 | 37.7,15.9 37.7,18.5 36.3,19.9 36.2,19.9 | v37.6,15.9 37.7,15.9 | 31.9,5.4 32,5.4 33,4.4 37.7,4.4 37.7,13.2 37.75,13.25
  Bottom 0.203: MK20DN512.89 23.75,15 24.45,15.7 31.15,15.7 31.35,15.9 MK20DN512.75 32.2,15.9 v37.6,15.9 41.2,15.9 44,13.1 C7.1 | 47.9,32.6 47.9,28.9 SD.VCC 48,28.8 48,28.4 48.8,27.6 48.8,21.1 C3.1 | 47.9,32.6 38.8,32.6 C9.1 38.7,32.7 37.8,33.6 28.3,33.6 BMP180.VDDIO 28.2,33.7 26.6,33.7 BMP180.VDD 26.5,33.6 25.3,33.6 25.3,29.8 MK20DN512.40 25.3,29.7 25.3,29.1 25.35,29.05 | 47.9,32.6 56,32.6 61.1,37.7 JTAG1.1 | 25.35,29.05 25.6,28.8 29,28.8 29.25,29.05 MK20DN512.48 | v28,39.1 24,43.1 R6.1 | 20.25,27.8 20.2,27.7 19.1,27.7 | 20.25,27.8 20.25,29.7 MK20DN512.30 | 19.1,27.7 17.9,27.7 17.15,26.95 16.45,26.95 MK20DN512.23 16.4,26.9 16.4,26.5 MK20DN512.22 16.3,26.5 10.5,26.5 JTAG.1 | 17.4,21.4 17.4,19.7 17.2,19.5 16.6,19.5 16.5,19.4 MK20DN512.8 | 17.4,21.4 16.5,21.4 MK20DN512.12 | 19.1,22.7 18.8,22.7 17.5,21.4 17.4,21.4 | 19.1,22.7 23.7,22.7 | 23.7,22.7 27.4,22.7 27.6,22.9 32.1,22.9 MK20DN512.61 | 23.7,22.7 v23.7,23.2 | 19.1,22.7 19.1,27.7 | 25.35,29.05 24.1,27.8 20.25,27.8
VCC-ISO  (via drill 0.33)
  Top 0.254: 26.2,27 26.2,25.5 D3.C | 26.2,27 26.2,28.1 LDO0.1 | v27.8,27 27.8,27.8 28.1,28.1 LDO0.3 | v26.3,27 26.2,27 | v16.8,34.8 16.8,32.9 R7.2 19.9,29.8 19.9,28.5 v21.2,27.2
  Bottom 0.254: v27.8,27 v26.3,27 26.2,27 26,27.2 v21.2,27.2 | STC3100.VCC 15.9,38.3 16.5,38.3 16.7,38.1 16.7,35 | 16.7,35 3.5,35 SWITCH.3 | v16.8,34.8 16.7,34.9 16.7,35
VPERM
  Top 0.203: LDO1.5 4,9 5.8,10.8 5.8,18.4 6.2,18.8 20.9,18.8 20.9,9.2 21.8,8.3 23,8.3 MT3339.P$4